# Altium schematic sheet IMU.SchDoc
size A4; SheetNumber: 7; SheetTotal: 7
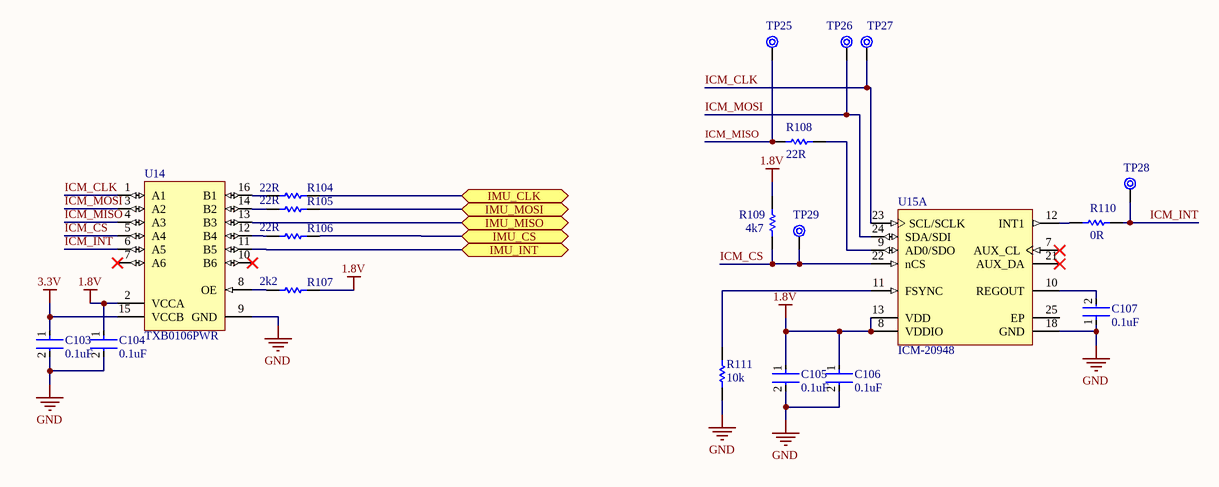
[diagram p0: IMU.SchDoc]

## Parts
C103  0.1uF  [FP-C0805C-DN-MFG]
C104  0.1uF  [FP-C0805C-DN-MFG]
C105  0.1uF  [FP-C0805C-DN-MFG]
C106  0.1uF  [FP-C0805C-DN-MFG]
C107  0.1uF  [FP-C0805C-DN-MFG]
R104  22R  [RESC2013X50X30LL20T20]
R105  22R  [RESC2013X50X30LL20T20]
R106  22R  [RESC2013X50X30LL20T20]
R107  2k2  [RESC2013X50X30LL20T20]
R108  22R  [RESC2013X50X30LL20T20]
R109  4k7  [RESC2013X50X30LL20T20]
R110  0R  [RESC1609X50X30NL8T20]
R111  10k  [RESC2013X50X30LL20T20]
TP25  Test Point 1mm  [Pad 1mm]  (value not drawn)
TP26  Test Point 1mm  [Pad 1mm]  (value not drawn)
TP27  Test Point 1mm  [Pad 1mm]  (value not drawn)
TP28  Test Point 1mm  [Pad 1mm]  (value not drawn)
TP29  Test Point 1mm  [Pad 1mm]  (value not drawn)
U14  TXB0106PWR  [PW0016A_L]
U15  ICM-20948  [TDK-QFN-24_L]  (part A of 2)

## Ports
IMU_CLK (bidir, see MCU[7A]), IMU_CS (bidir, see MCU[5B]), IMU_INT (bidir, see MCU[5B]), IMU_MISO (bidir, see MCU[7B]), IMU_MOSI (bidir, see MCU[5A])

## Nets
1.8V: C104.1 C105.1 C106.1 R107.2 R109.2 U14.2(VCCA) U15.8(VDDIO) U15.13(VDD)
3.3V: C103.1 U14.15(VCCB)
GND: C103.2 C104.2 C105.2 C106.2 C107.1 R111.1 U14.9(GND) U15.18(GND)
ICM_CLK: TP27.1 U14.1(A1) U15.23(SCL/SCLK)
ICM_CS: R109.1 TP29.1 U14.5(A4) U15.22(nCS)
ICM_INT: R110.2 TP28.1 U14.6(A5)
ICM_MISO: R108.1 TP25.1 U14.4(A3)
ICM_MOSI: TP26.1 U14.3(A2) U15.24(SDA/SDI)
IMU_CLK: R104.2 ; port IMU_CLK
IMU_CS: R106.2 ; port IMU_CS
IMU_INT: U14.11(B5) ; port IMU_INT
IMU_MISO: U14.13(B3) ; port IMU_MISO
IMU_MOSI: R105.2 ; port IMU_MOSI
NetC107_2: C107.2 U15.10(REGOUT)
NetR104_1: R104.1 U14.16(B1)
NetR105_1: R105.1 U14.14(B2)
NetR106_1: R106.1 U14.12(B4)
NetR107_1: R107.1 U14.8(OE)
NetR108_2: R108.2 U15.9(AD0/SDO)
NetR110_1: R110.1 U15.12(INT1)
NetR111_2: R111.2 U15.11(FSYNC)

Not connected (* = marked no-connect by the designer): U14 7(A6)* 10(B6)*; U15 7(AUX_CL)* 21(AUX_DA)* 25(EP)

## Library data of the parts
C103-C107 = CMP-2007-00279-2: CAP CER 0.1UF 50V X7R 0805; Manufacturer Part Number: C0805C104K5RACTU; Manufacturer: KEMET; Value: 0.10 μF; Tolerance: 0.1; Temperature Coefficient: 30ppm/°C; Material: Ceramic; Device Class L2: Capacitors; Temperature Range Low: -55°C; Voltage Rating: 50 V; Digikey Description: CAP CER 0.1UF 50V X7R 0805; Category: Cap; ComponentLink2Description: Datasheet; Octopart: https://octopart.com/c0805c104k5ractu-kemet-143926; RoHS: TRUE; ComponentLink2URL: https://content.kemet.com/datasheets/KEM_C1003_C0G_SMD.pdf; Temperature Characteristic: X7R; Temperature: -55°C to +125°C; Height: 0.88mm; Temperature Range High: +125°C; Device Class L1: Passive Components; Automotive: No; Lead Free: Yes; Ipc Land Pattern Name: CAPC200125X78; Device Class L3: Ceramic Capacitors; Mouser Description: Cap Ceramic 0.1uF 50V X7R 10% SMD 2.0 x 1.2 mm 125 C Paper T/R; Capacitance: 0.10 μF; Package: C0805C-DN
R104-R109 R111 = CMP-2001-04896-1: 0805; Manufacturer: Vishay Dale; Part Number: CRCW08050000Z0EA
R110 = CMP-2000-03816-5: Chip Resistor, 0 Ohm, Jumper, 100 mW, -55 to 155 degC, 0603 (1608 Metric), RoHS, Tape and Reel; Manufacturer: Vishay Semiconductor; Voltage Rating: 75 V; Package Quantity: 5000; DatasheetVersion: 06/2012; Min Operating Temperature: -55 degC; ComponentLink1URL: http://www.vishay.com/; Mounting Technology: Surface Mount; Height: 0.45 mm; ComponentLink1Description: Manufacturer URL; REACH SVHC: Unknown; PackageReference: 0603; Packaging: Tape and Reel; Max Operating Temperature: 155 degC; Mount: Surface Mount; ComponentLink2Description: Datasheet; PackageDescription: 2-Pin Surface Mount Device, Body 1.575 x 0.85 mm; Length: 1.55 mm; ComponentLink2URL: http://www.vishay.com/docs/20035/dcrcwe3.pdf; Pins: 2; RoHSCompliant: true
U14 = CMP-2000-07336-1: 6-Bit Bidirectional Level-Shifting and Voltage Translator with Auto-Direction Sensing and +/- 15-kV ESD Protection, 1.2 to 3.6 V, -40 to 85 degC, 16-Pin TSSOP (PW), Green (RoHS & no Sb/Br), Tape and Reel; Manufacturer: Texas Instruments; Dynamic Catalog: TXBSeries; Differential - Input: Output:No/No; Number of Bits: 6; Output Type: Logic; Propagation Delay (Max): 4ns; Number of Outputs/Channel: 1; Voltage - Supply: 1.2V~3.6V,1.65V~5.5V; Data Rate: 100Mbps; Product Training Modules: VoltageLevelTranslation; Other Names: 296-23759-1; Logic Function: Translator,Bidirectional; Packaging: CutTape(CT); Datasheet URL: http://www.ti.com/general/docs/lit/getliterature.tsp?genericPartNumber=TXB0106&fileType=pdf; Package Description: 16-Pin Small Outline Package Integrated Circuit, Body 5 x 4.4 mm, Pitch 0.65 mm; Standard Package: 1; Series: -; Manufacturer URL: http://www.ti.com/; Operating Temperature: -40°C~85°C; Supplier Device Package: 16-TSSOP; Package Reference: PW16; Number of Channels: 6; Category: IntegratedCircuits(ICs); Package / Case: 16-TSSOP(0.173",4.40mmWidth); Family: Logic-Translators; Datasheet Version: Rev. B, 06/2015; Mounting Technology: SurfaceMount; Input Type: Logic
U15 = CMP-2000-07532-1: World’s Lowest Power 9-Axis MEMS MotionTracking(TM) Device, 1.71 to 3.6 V, -40 to 85 degC, 24-Pin QFN, RoHS, Tape and Reel; Manufacturer: TDK; Package Description: 24-Pin Quad Flat No-lead Package, Body 3 x 3 mm, Pitch 0.4 mm; Datasheet Version: Rev. 1.3, 06/2017; Package Reference: QFN-24; Mounting Technology: SurfaceMount; Datasheet URL: https://www.invensense.com/wp-content/uploads/2016/06/DS-000189-ICM-20948-v1.3.pdf; Manufacturer URL: http://www.tdk.com/